# Altium project Kit_AVR_328P.PrjPCB
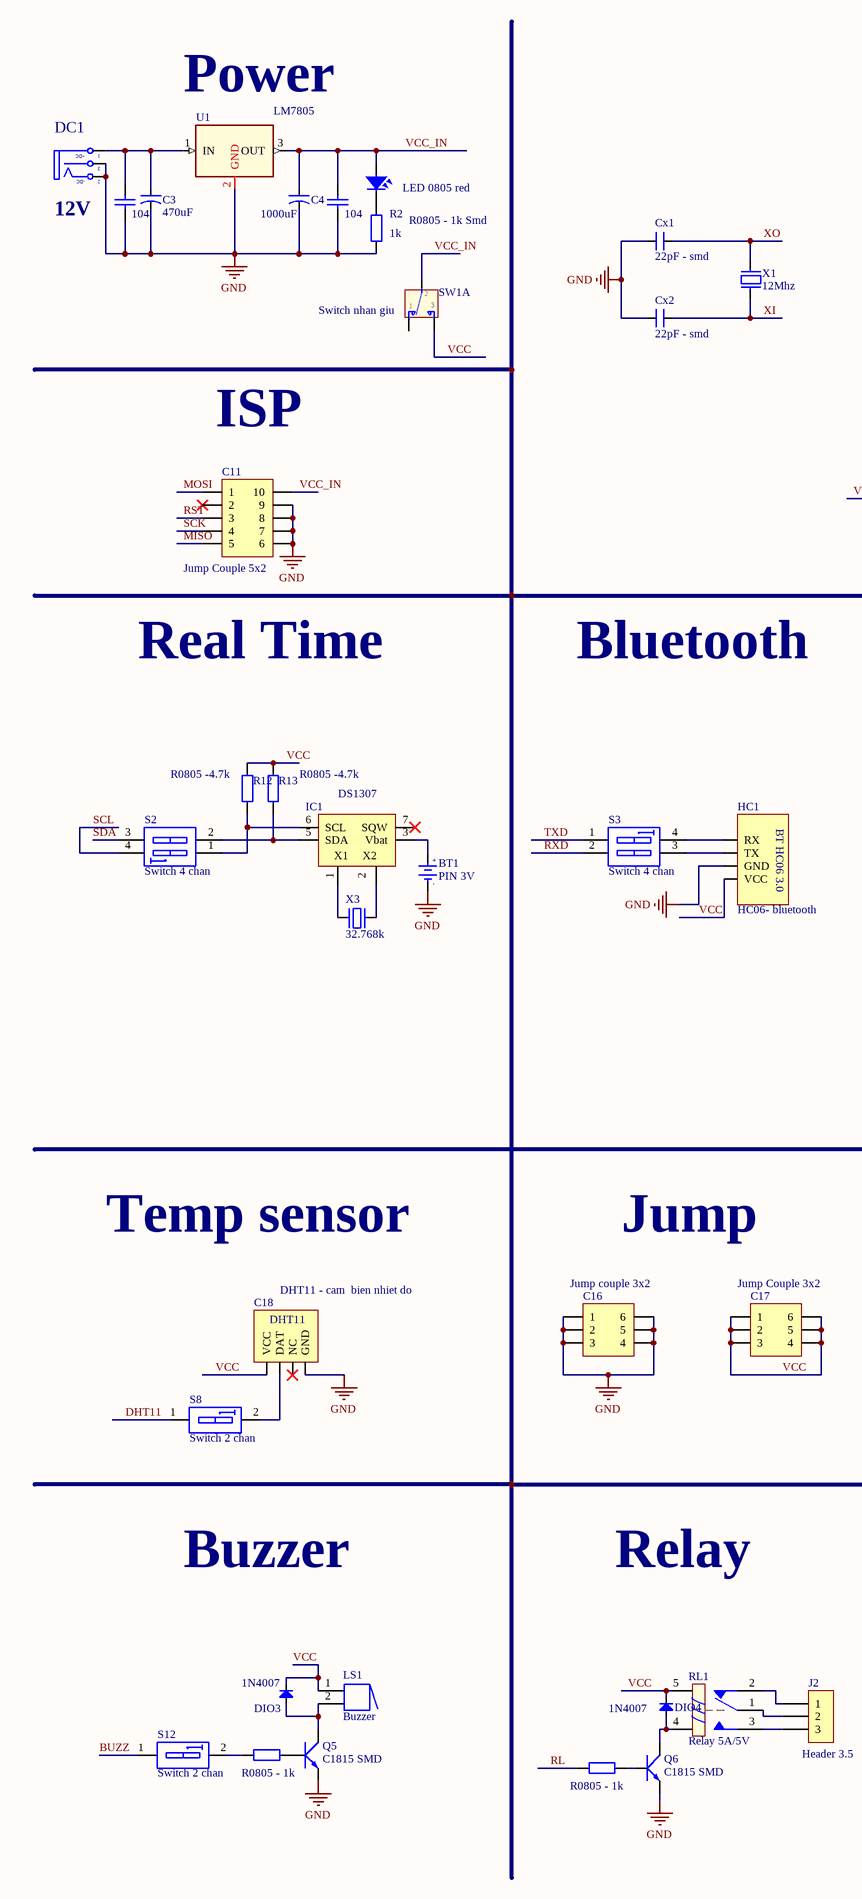
[diagram p0: Kit_AVR_328P.SchDoc, left]
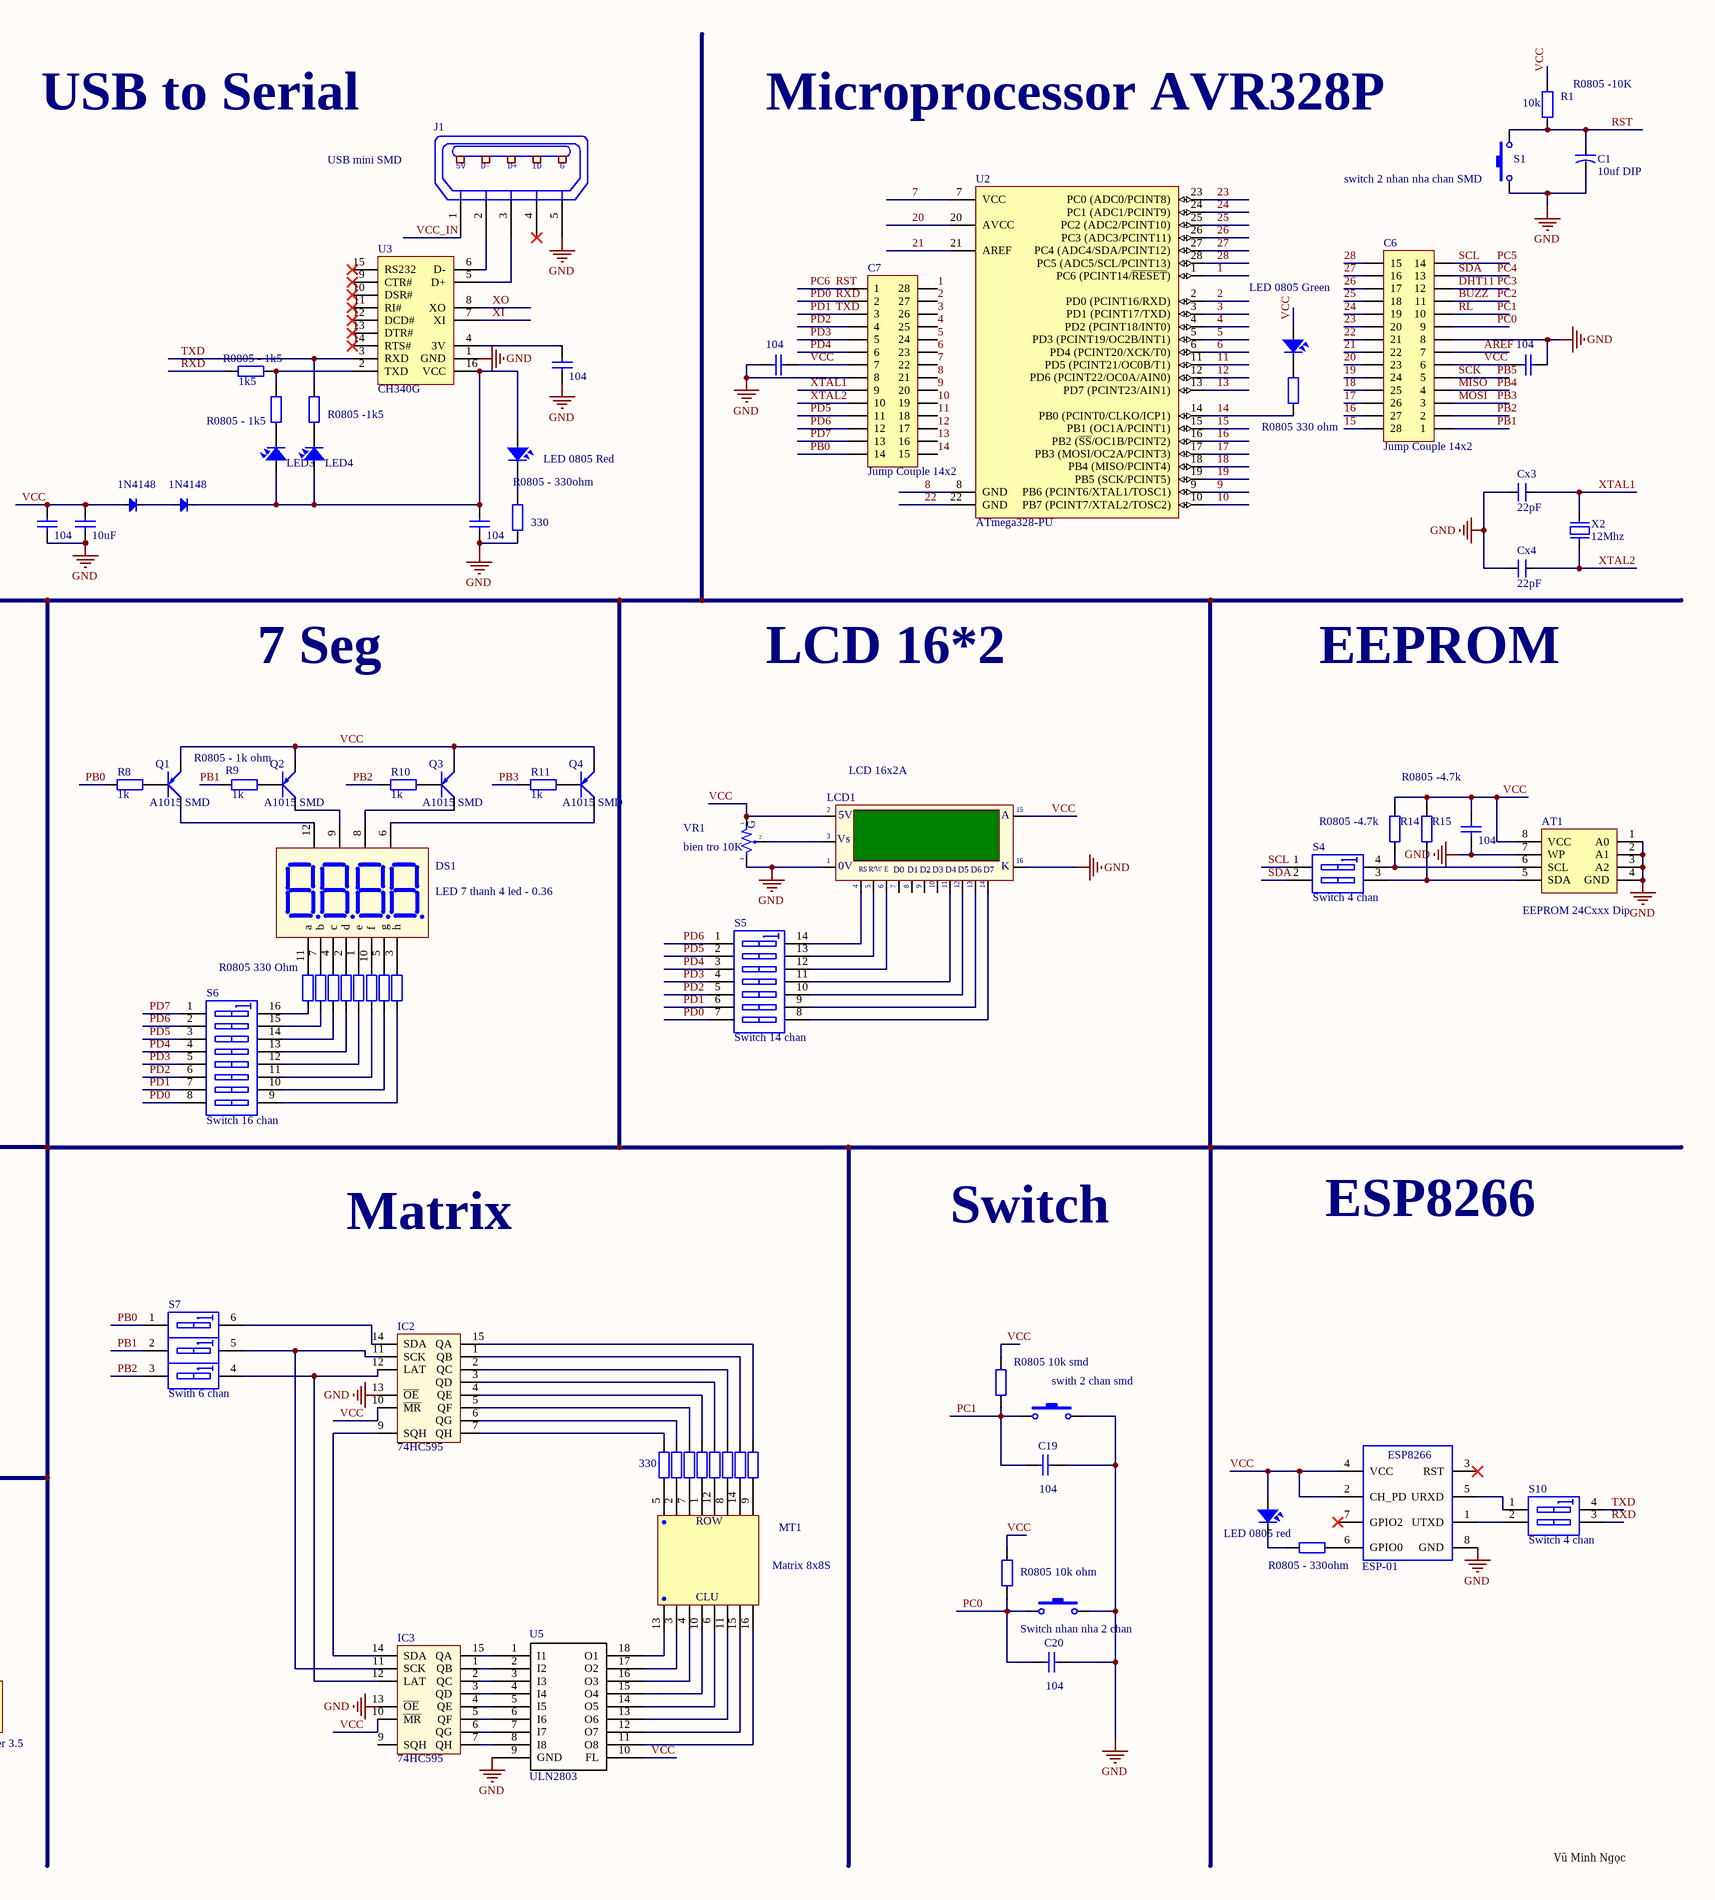
[diagram p1: Kit_AVR_328P.SchDoc, right]
1 sheet, 112 parts. Net scope: global (net labels, ports and power ports of the same name join across sheets).
Board file: Kit_AVR_328P.PcbDoc

## Sheet Kit_AVR_328P.SchDoc
size C

### Parts
AT1  EEPROM 24Cxxx Dip  [Dip8]
BT1  PIN 3V  [PIN3V]
C1  10uf DIP  [CA-ALU-2.54]
C2  104  [C0805]
C3  470uF  [CA-ALU-2.54]
C4  1000uF  [CA-ALU-2.54]
C5  104  [C0805]
C6  Jump Couple 14x2  [JP14-D2T]
C7  Jump Couple 14x2  [JP14-D2T]
C8  104  [C0805]
C9  104  [C0805]
C10  104  [C0805]
C11  Jump Couple 5x2  [JP5-D2T]
C12  104  [C0805]
C13  10uF  [C0805]
C14  104  [C0805]
C15  104  [C0805]
C16  Jump couple 3x2  [JP3-D2T]
C17  Jump Couple 3x2  [JP3-D2T]
C18  DHT11 - cam  bien nhiet do  [DHT11]
C19  104  [C0805]
C20  104  [C0805]
Cx1  22pF - smd  [CN-SMD-0805]
Cx2  22pF - smd  [CN-SMD-0805]
Cx3  22pF  [CN-SMD-0805]
Cx4  22pF  [CN-SMD-0805]
DC1  12V  [DC-IN]
DIO1  1N4148  [DIO-SMD-123]
DIO2  1N4148  [DIO-SMD-123]
DIO3  1N4007  [DIO-SMD-106]
DIO4  1N4007  [DIO-SMD-123]
DS1  LED 7 thanh 4 led - 0.36  [LED7SEG-4-0.36]
HC1  HC06- bluetooth  [HC06-1]
IC1  DS1307  [DIP8]
IC2  74HC595  [SO16]
IC3  74HC595  [SO16]
J1  USB mini SMD  [USB-M1]
J2  Header 3.5  [KF3-3.5]
LCD1  LCD 16x2A  [LCD16X2]
LED1  LED 0805 red  [LED-0805-Yellow]
LED2  LED 0805 Green  [LED-0805-Yellow]
LED3  LED 0805 red  [LED-0805-Yellow]  (value not drawn)
LED4  LED 0805 red  [LED-0805-Yellow]  (value not drawn)
LED5  LED 0805 Red  [LED-0805-Yellow]
LED6  LED 0805 red  [LED-0805-Yellow]
LS1  Buzzer  [Buzzer]
MT1  Matrix 8x8S  [Matrix]
Q1  A1015 SMD  [SOT23B]
Q2  A1015 SMD  [SOT23B]
Q3  A1015 SMD  [SOT23B]
Q4  A1015 SMD  [SOT23B]
Q5  C1815 SMD  [SOT23B]
Q6  C1815 SMD  [SOT23B]
R1  R0805 -10K  value 10k  [DIEN TRO 0805]
R2  R0805 - 1k Smd  value 1k  [DIEN TRO 0805]
R3  R0805 - 1k5  value 1k5  [DIEN TRO 0805]
R4  R0805 330 ohm  [DIEN TRO 0805]
R5  R0805 - 1k5  [DIEN TRO 0805]
R6  R0805 -1k5  [DIEN TRO 0805]
R7  R0805 - 330ohm  value 330  [DIEN TRO 0805]
R8  value 1k  [DIEN TRO 0805]  (hidden comment: R0805 - 1k ohm)
R9  R0805 - 1k ohm  value 1k  [DIEN TRO 0805]
R10  value 1k  [DIEN TRO 0805]  (hidden comment: R0805 - 1k ohm)
R11  value 1k  [DIEN TRO 0805]  (hidden comment: R0805 - 1k ohm)
R12  R0805 -4.7k  [DIEN TRO 0805]
R13  R0805 -4.7k  [DIEN TRO 0805]
R14  R0805 -4.7k  [DIEN TRO 0805]
R15  R0805 -4.7k  [DIEN TRO 0805]
R16  R0805 330 Ohm  [DIEN TRO 0805]
R17  R0805 330 Ohm  [DIEN TRO 0805]  (value not drawn)
R18  R0805 330 Ohm  [DIEN TRO 0805]  (value not drawn)
R19  R0805 330 Ohm  [DIEN TRO 0805]  (value not drawn)
R20  R0805 330 Ohm  [DIEN TRO 0805]  (value not drawn)
R21  R0805 330 Ohm  [DIEN TRO 0805]  (value not drawn)
R22  R0805 330 Ohm  [DIEN TRO 0805]  (value not drawn)
R23  R0805 330 Ohm  [DIEN TRO 0805]  (value not drawn)
R24  R0805 10k smd  [DIEN TRO 0805]
R25  value 330  [DIEN TRO 0805]  (hidden comment: R0805 -330 ohm)
R26  R0805 -330 ohm  [DIEN TRO 0805]  (value not drawn)
R27  R0805 -330 ohm  [DIEN TRO 0805]  (value not drawn)
R28  R0805 -330 ohm  [DIEN TRO 0805]  (value not drawn)
R29  R0805 -330 ohm  [DIEN TRO 0805]  (value not drawn)
R30  R0805 -330 ohm  [DIEN TRO 0805]  (value not drawn)
R31  R0805 -330 ohm  [DIEN TRO 0805]  (value not drawn)
R32  R0805 -330 ohm  [DIEN TRO 0805]  (value not drawn)
R33  R0805 - 330ohm  [DIEN TRO 0805]
R34  R0805 10k ohm  [DIEN TRO 0805]
R35  R0805 - 1k  [DIEN TRO 0805]
R36  R0805 - 1k  [DIEN TRO 0805]
RL1  Relay 5A/5V  [RL_SPDT_10A]
S1  switch 2 nhan nha chan SMD  [SW-SMD]
S2  Switch 4 chan  [SW-DIP2]
S3  Switch 4 chan  [SW-DIP2]
S4  Switch 4 chan  [SW-DIP2]
S5  Switch 14 chan  [SW-DIP7-1]
S6  Switch 16 chan  [SW-DIP8]
S7  Swith 6 chan  [SW-DIP3-1]
S8  Switch 2 chan  [SW-DIP1-1]
S9  swith 2 chan smd  [SW-SMD]
S10  Switch 4 chan  [SW-DIP2]
S11  Switch nhan nha 2 chan  [SW-SMD]
S12  Switch 2 chan  [SW-DIP1-1]
SW1  Switch nhan giu  [SW6]  (part A of 2)
U1  LM7805  [TO-263]
U2  ATmega328-PU  [DIP28]
U3  CH340G  [SO16]
U4  ESP-01  [ESP8266]
U5  ULN2803  [SO18]
VR1  bien tro 10K  [VR-S2]
X1  12Mhz  [XT2]
X2  12Mhz  [XT2]
X3  32.768k  [XT32k]

### Nets
GND: AT1.1(A0) AT1.2(A1) AT1.3(A2) AT1.4(GND) AT1.7(WP) BT1.2(GND) C1.2 C2.1 C3.2 C4.2 C5.1 C6.8 C7.8 C8.1 C9.2 C10.1 C11.6 C11.7 C11.8 C11.9 C12.1 C13.1 C14.1 C15.1 C16.1 C16.2 C16.3 C16.4 C16.5 C16.6 C18.4(GND) C19.2 C20.2 Cx1.2 Cx2.2 Cx3.2 Cx4.2 DC1.2(TN) DC1.3(S) HC1.3(GND) IC1.4(GND) IC2.8(GND) IC2.13(~{OE}) IC3.8(GND) IC3.13(~{OE}) J1.5(P5) LCD1.1(GND) LCD1.16(K) Q5.1(E) Q6.1(E) R2.1 R7.1 S1.1 S9.2 S11.2 U1.2(GND) U3.1(GND) U4.8(GND) U5.9(GND) VR1.3
VCC: AT1.8(VCC) C6.6 C7.7 C8.2 C9.1 C12.2 C13.2 C15.2 C17.1 C17.2 C17.3 C17.4 C17.5 C17.6 C18.1(VCC) DIO1.1(A) DIO3.2(K) DIO4.2(K) HC1.4(VCC) IC1.8(VCC) IC2.10(~{MR}) IC2.16(VCC) IC3.10(~{MR}) IC3.16(VCC) LCD1.2(VDD) LCD1.15(A) LED2.1 LED6.1 LS1.1 Q1.1(E) Q2.1(E) Q3.1(E) Q4.1(E) R1.2 R12.2 R13.2 R14.2 R15.2 R24.2 R34.2 RL1.5 SW1.3 U4.2(CH_PD) U4.4(VCC) U5.10(FL) VR1.1
1: C7.28 U2.1(PC6_(PCINT14/~{RESET}))
2: C7.27 U2.2(PD0_(PCINT16/RXD))
3: C7.26 U2.3(PD1_(PCINT17/TXD))
4: C7.25 U2.4(PD2_(PCINT18/INT0))
5: C7.24 U2.5(PD3_(PCINT19/OC2B/INT1))
6: C7.23 U2.6(PD4_(PCINT20/XCK/T0))
7: C7.22 U2.7(VCC)
8: C7.21 U2.8(GND)
9: C7.20 U2.9(PB6_(PCINT6/XTAL1/TOSC1))
10: C7.19 U2.10(PB7_(PCINT7/XTAL2/TOSC2))
11: C7.18 U2.11(PD5_(PCINT21/OC0B/T1))
12: C7.17 U2.12(PD6_(PCINT22/OC0A/AIN0))
13: C7.16 U2.13(PD7_(PCINT23/AIN1))
14: C7.15 R4.1 U2.14(PB0_(PCINT0/CLKO/ICP1))
15: C6.28 U2.15(PB1_(OC1A/PCINT1))
16: C6.27 U2.16(PB2_(~{SS}/OC1B/PCINT2))
17: C6.26 U2.17(PB3_(MOSI/OC2A/PCINT3))
18: C6.25 U2.18(PB4_(MISO/PCINT4))
19: C6.24 U2.19(PB5_(SCK/PCINT5))
20: C6.23 U2.20(AVCC)
21: C6.22 U2.21(AREF)
22: C6.21 U2.22(GND)
23: C6.20 U2.23(PC0_(ADC0/PCINT8))
24: C6.19 U2.24(PC1_(ADC1/PCINT9))
25: C6.18 U2.25(PC2_(ADC2/PCINT10))
26: C6.17 U2.26(PC3_(ADC3/PCINT11))
27: C6.16 U2.27(PC4_(ADC4/SDA/PCINT12))
28: C6.15 U2.28(PC5_(ADC5/SCL/PCINT13))
AREF: C6.7
BUZZ: C6.11 S12.1  [also labelled PC2]
DHT11: C6.12 S8.1  [also labelled PC3]
MISO: C6.4 C11.5  [also labelled PB4]
MOSI: C6.3 C11.1 R11.2  [also labelled PB3]
PB0: C7.14 R8.2 S7.1
PB1: C6.1 R9.2 S7.2
PB2: C6.2 R10.2 S7.3
PB5: C6.5 C11.4  [also labelled SCK]
PC0: C6.9 C20.1 R34.1 S11.1
PC1: C6.10 C19.1 R24.1 R36.2 S9.1  [also labelled RL]
PC4: C6.13 S2.3 S4.2  [also labelled SDA]
PC5: C6.14 S2.4 S4.1  [also labelled SCL]
PC6: C1.1 C7.1 C11.3 R1.1 S1.2  [also labelled RST]
PD0: C7.2 R3.1 S3.2 S5.7 S6.8 S10.3  [also labelled RXD]
PD1: C7.3 R6.1 S3.1 S5.6 S6.7 S10.4 U3.3(RXD)  [also labelled TXD]
PD2: C7.4 S5.5 S6.6
PD3: C7.5 S5.4 S6.5
PD4: C7.6 S5.3 S6.4
PD5: C7.11 S5.2 S6.3
PD6: C7.12 S5.1 S6.2
PD7: C7.13 S6.1
VCC_IN: C4.1 C5.2 C11.10 J1.1(P1) LED1.1 SW1.2 U1.3(OUT)
XI: Cx2.1 U3.7(XI) X1.1
XO: Cx1.1 U3.8(XO) X1.2
XTAL1: C7.9 Cx3.1 X2.2
XTAL2: C7.10 Cx4.1 X2.1
NetAT1_5: AT1.5(SDA) R15.1 S4.3
NetAT1_6: AT1.6(SCL) R14.1 S4.4
NetBT1_1: BT1.1(+3V) IC1.3(Vbat)
NetC2_2: C2.2 C3.1 DC1.1(T) U1.1(IN)
NetC10_2: C10.2 U3.4(3V)
NetC14_2: C14.2 DIO2.2(K) LED3.1 LED4.1 LED5.1 U3.16(VCC)
NetC18_2: C18.2(DAT) S8.2
NetDIO1_2: DIO1.2(K) DIO2.1(A)
NetDIO3_1: DIO3.1(A) LS1.2 Q5.2(C)
NetDIO4_1: DIO4.1(A) Q6.2(C) RL1.4
NetDS1_1: DS1.1(e) R20.2
NetDS1_2: DS1.2(d) R19.2
NetDS1_3: DS1.3(h) R23.2
NetDS1_4: DS1.4(c) R18.2
NetDS1_5: DS1.5(g) R22.2
NetDS1_6: DS1.6(V4) Q4.2(C)
NetDS1_7: DS1.7(b) R17.2
NetDS1_8: DS1.8(V3) Q3.2(C)
NetDS1_9: DS1.9(V2) Q2.2(C)
NetDS1_10: DS1.10(f) R21.2
NetDS1_11: DS1.11(a) R16.2
NetDS1_12: DS1.12(V1) Q1.2(C)
NetHC1_1: HC1.1(RX) S3.4
NetHC1_2: HC1.2(TX) S3.3
NetIC1_1: IC1.1(X1) X3.1
NetIC1_2: IC1.2(X2) X3.2
NetIC1_5: IC1.5(SDA) R13.1 S2.2
NetIC1_6: IC1.6(SCL) R12.1 S2.1
NetIC2_1: IC2.1(QB) R31.1
NetIC2_2: IC2.2(QC) R30.1
NetIC2_3: IC2.3(QD) R29.1
NetIC2_4: IC2.4(QE) R28.1
NetIC2_5: IC2.5(QF) R27.1
NetIC2_6: IC2.6(QG) R26.1
NetIC2_7: IC2.7(QH) R25.1
NetIC2_9: IC2.9(SQH) IC3.14(SDA)
NetIC2_11: IC2.11(SCK) IC3.11(SCK) S7.5
NetIC2_12: IC2.12(LAT) IC3.12(LAT) S7.4
NetIC2_14: IC2.14(SDA) S7.6
NetIC2_15: IC2.15(QA) R32.1
NetIC3_1: IC3.1(QB) U5.2(I2)
NetIC3_2: IC3.2(QC) U5.3(I3)
NetIC3_3: IC3.3(QD) U5.4(I4)
NetIC3_4: IC3.4(QE) U5.5(I5)
NetIC3_5: IC3.5(QF) U5.6(I6)
NetIC3_6: IC3.6(QG) U5.7(I7)
NetIC3_7: IC3.7(QH) U5.8(I8)
NetIC3_15: IC3.15(QA) U5.1(I1)
NetJ1_2: J1.2(P2) U3.6(D-)
NetJ1_3: J1.3(P3) U3.5(D+)
NetJ2_1: J2.1 RL1.2
NetJ2_2: J2.2 RL1.1
NetJ2_3: J2.3 RL1.3
NetLCD1_3: LCD1.3(VEE) VR1.2
NetLCD1_4: LCD1.4(RS) S5.14
NetLCD1_5: LCD1.5(R/~{W}) S5.13
NetLCD1_6: LCD1.6(~{EN}) S5.12
NetLCD1_11: LCD1.11(D4) S5.11
NetLCD1_12: LCD1.12(D5) S5.10
NetLCD1_13: LCD1.13(D6) S5.9
NetLCD1_14: LCD1.14(D7) S5.8
NetLED1_2: LED1.2 R2.2
NetLED2_2: LED2.2 R4.2
NetLED3_2: LED3.2 R5.2
NetLED4_2: LED4.2 R6.2
NetLED5_2: LED5.2 R7.2
NetLED6_2: LED6.2 R33.2
NetMT1_1: MT1.1(H4) R28.2
NetMT1_2: MT1.2(H2) R26.2
NetMT1_3: MT1.3(C2) U5.17(O2)
NetMT1_4: MT1.4(C3) U5.16(O3)
NetMT1_5: MT1.5(H1) R25.2
NetMT1_6: MT1.6(C5) U5.14(O5)
NetMT1_7: MT1.7(H3) R27.2
NetMT1_8: MT1.8(H6) R30.2
NetMT1_9: MT1.9(H8) R32.2
NetMT1_10: MT1.10(C4) U5.15(O4)
NetMT1_11: MT1.11(C6) U5.13(O6)
NetMT1_12: MT1.12(H5) R29.2
NetMT1_13: MT1.13(C1) U5.18(O1)
NetMT1_14: MT1.14(H7) R31.2
NetMT1_15: MT1.15(C7) U5.12(O7)
NetMT1_16: MT1.16(C8) U5.11(O8)
NetQ1_3: Q1.3(B) R8.1
NetQ2_3: Q2.3(B) R9.1
NetQ3_3: Q3.3(B) R10.1
NetQ4_3: Q4.3(B) R11.1
NetQ5_3: Q5.3(B) R35.1
NetQ6_3: Q6.3(B) R36.1
NetR3_2: R3.2 R5.1 U3.2(TXD)
NetR16_1: R16.1 S6.16
NetR17_1: R17.1 S6.15
NetR18_1: R18.1 S6.14
NetR19_1: R19.1 S6.13
NetR20_1: R20.1 S6.12
NetR21_1: R21.1 S6.11
NetR22_1: R22.1 S6.10
NetR23_1: R23.1 S6.9
NetR33_1: R33.1 U4.6(GPIO0)
NetR35_2: R35.2 S12.2
NetS10_1: S10.1 U4.5(URXD)
NetS10_2: S10.2 U4.1(UTXD)

Not connected (* = marked no-connect by the designer): C11 2*; C18 3(NC)*; IC1 7(SQW)*; IC3 9(SQH); J1 4(P4)*; LCD1 7(D0) 8(D1) 9(D2) 10(D3); SW1 1; U3 9(CTR#)* 10(DSR#)* 11(RI#)* 12(DCD#)* 13(DTR#)* 14(RTS#)* 15(RS232)*; U4 3(RST)* 7(GPIO2)*

### Notes on the sheet
- (near U1) Power
- USB to Serial
- Microprocessor AVR328P
- ISP
- Real Time
- Bluetooth
- 7 Seg
- LCD 16*2
- EEPROM
- ESP8266
- Temp sensor
- Jump
- Matrix
- Switch
- Buzzer
- Relay
- Vũ Minh Ngọc
- (in symbol DCIN) +DC; -DC
- (in symbol ESP8266-01) ESP8266
- (in symbol HC06-1) BT HC06 3.0
- (in symbol LCD16x2A) 5V; Vs; |; 0V; R/W; E
- (in symbol LED 8x8S) ROW; CLU
- (in symbol PIN 3V) +; -
- (in symbol USB-5) 5V; D-; D+; ID; G
- (in symbol VR-S) G

### Library data of the parts
AT1 = EEPROM.24Cxxx: 2-wire Serial   EEPROM  512K (65,536 x 8); Manufacturer: Atmel; Value: 512Kb; ComponentLink2Description: Open datasheet; ComponentLink2URL: H:\LIBRARY\LIBRARY.Datasheet\24c512.pdf
BT1 = PIN 3V: Battery 3VDC; Value: PIN 3V
C1 C3 C4 = CN-ALU-DIP: Capacitor (Semiconductor SIM Model); Value: 104; LatestRevisionDate: 17-Jul-2002; LatestRevisionNote: Re-released for DXP Platform.; PackageReference: C1206; Publisher: Altium Limited
C2 C5 C8-C10 C12-C15 C19 C20 = CapSMD: Capacitor; Value: 33p; Published: 8-Jun-2000; LatestRevisionDate: 17-Jul-2002; LatestRevisionNote: Re-released for DXP Platform.; PackageReference: RAD-0.3; Publisher: Altium Limited
C6 C7 = JP14x2: WR-PHD 2.54 mm Dual Socket Header; Manufacturer: W¨¹rth Elektronik eiSos GmbH; partNo: 61302821821; ComponentLink1 Description: Manufacturer; ComponentLink2 Description: Datasheet; NoPins: 28; Created Date: 29 March 2013; ComponentLink1URL: http://www.we-online.com; ComponentLink2URL: http://katalog.we-online.de/em/datasheet/6130xx21821.pdf; Created by: Karrer Zheng
C11 = JP5x2: WR-PHD 2.54 mm Dual Socket Header; Manufacturer: W¨¹rth Elektronik eiSos GmbH; partNo: 61301021821; ComponentLink1 Description: Manufacturer; ComponentLink2 Description: Datasheet; NoPins: 10; Created Date: 29 March 2013; ComponentLink1URL: http://www.we-online.com; ComponentLink2URL: http://katalog.we-online.de/em/datasheet/6130xx21821.pdf; Created by: Karrer Zheng
C16 C17 = JP3x2: WR-PHD 2.54 mm Dual Socket Header; Manufacturer: W¨¹rth Elektronik eiSos GmbH; partNo: 61300621821; ComponentLink1 Description: Manufacturer; ComponentLink2 Description: Datasheet; NoPins: 06; Created Date: 29 March 2013; ComponentLink1URL: http://www.we-online.com; ComponentLink2URL: http://katalog.we-online.de/em/datasheet/6130xx21821.pdf; Created by: Karrer Zheng
C18 = DHT11: Manufacturer: W¨¹rth Elektronik eiSos GmbH; partNo: 613004143121; ComponentLink1 Description: Manufacturer; ComponentLink2 Description: Datasheet; NoPins: 04; Created Date: 29 March 2013; ComponentLink1URL: http://www.we-online.com; ComponentLink2URL: http://katalog.we-online.de/em/datasheet/6130xx143121.pdf; Created by: Karrer Zheng
Cx1-Cx4 = CN: Value: 33pF
DC1 = DCIN: Jac DC input; Value: Jac DC
DIO1-DIO4 = Diode SMD: Default Diode; Code - JEDEC: DO-214-AB; Value: 1N5007; Published: 8-Jun-2000; Revision: July-2002: Re-released for DXP Platform.; Publisher: Altium Limited
DS1 = LED7SEG-4: Four 7 Seg Dipslay; Value: LED 7Q SEG
HC1 = HC06-1: Manufacturer: W¨¹rth Elektronik eiSos GmbH; partNo: 613004143121; ComponentLink1 Description: Manufacturer; ComponentLink2 Description: Datasheet; NoPins: 04; Created Date: 29 March 2013; ComponentLink1URL: http://www.we-online.com; ComponentLink2URL: http://katalog.we-online.de/em/datasheet/6130xx143121.pdf; Created by: Karrer Zheng
IC1 = DS1307: Real Timer Serial; Value: DS1307
IC2 IC3 = 74595: 8 Bit Serial input - Parallel Output; Value: 74HC595
J1 = USB-5: Manufacturer: FCI; Manufacturer Part Number: 10118193-0001LF; Connector Type: USB - micro B; Number of Contacts: 5; Gender: Receptacle; Specifications: USB 2.0; .Creator: MM; .Checked PCB: RF; Supplier 1: Digi-Key; RoHS: RoHS Compliant; Category: Connectors, Interconnects; Stock 1: 28642; Pricing 1: 1=0.46, 10=0.433, 25=0.3712, 50=0.3156, 100=0.3032, 250=0.27224, 500=0.25988 (USD); Packaging: Cut Tape (CT); Mounting Type: Surface Mount, Right Angle, Horizontal; Features: Shielded, Solder Retention; Ingress Protection: -; ComponentLink1URL: http://portal.fciconnect.com/Comergent//fci/drawing/10118193.pdf; ComponentLink1Description: http://portal.fciconnect.com/Comergent//fci/drawing/10118193.pdf; Supplier Part Number 1: 609-4616-1-ND; .Checked SCH: MM
J2 = KF3: Manufacturer: Würth Elektronik eiSos GmbH; partNo: 691103110003; ComponentLink1 Description: Manufacturer; ComponentLink2 Description: Datasheet; NoPins: 3; Created Date: 29 October 2013; ComponentLink1URL: http://www.we-online.com; ComponentLink2URL: http://katalog.we-online.de/em/datasheet/6911031100xx.pdf; Created by: Karrer Zheng
LCD1 = LCD16x2A: LCD dipslay 16 char, 2 line; Value: LCD16x2A
LED1-LED6 = LED SMD: Value: LED 3 - 5 ly 2 Colour
LS1 = Buzzer: Magnetic Transducer Buzzer; Published: 24-Mar-1999; LatestRevisionDate: 17-Dec-2003; LatestRevisionNote: Schematic revised, PCB Footprint replaced.; DatasheetDocument: 17-Dec-2003; PackageReference: ABSM-1574; Publisher: Altium Limited; ComponentLink1Description: Manufacturer Link; ComponentLink1URL: http://www.megastar.com/linecard/buzzmode/index.php
MT1 = LED 8x8S: Matrix 8x8,  Single colour; Value: Matrix 8x8S
Q1-Q4 = A1015: PNP 600mW, ECB; Value: A1015
Q5 Q6 = C1815: NPN 600mW, ECB; Value: C1815
R1-R3 R5 R7-R11 R24 R25 R34-R36 = R0805: Resistor SMD 0805; Published: 8-Jun-2000; LatestRevisionDate: 17-Jul-2002; LatestRevisionNote: Re-released for DXP Platform.; PackageReference: AXIAL-0.4; Publisher: Altium Limited
  R5: Value: 1k5
  R24 R34: Value: 10k
  R35 R36: Value: 1k
R4 R16-R23 R26-R33 = R0805: Resistor SMD 0805; Value: 330; Published: 8-Jun-2000; LatestRevisionDate: 17-Jul-2002; LatestRevisionNote: Re-released for DXP Platform.; PackageReference: AXIAL-0.4; Publisher: Altium Limited
R6 = R0805: Resistor SMD 0805; Value: 1k5; Published: 8-Jun-2000; LatestRevisionDate: 17-Jul-2002; LatestRevisionNote: Re-released for DXP Platform.; PackageReference: AXIAL-0.4; Publisher: Altium Limited
R12-R15 = R0805: Resistor SMD 0805; Value: 4.7k; Published: 8-Jun-2000; LatestRevisionDate: 17-Jul-2002; LatestRevisionNote: Re-released for DXP Platform.; PackageReference: AXIAL-0.4; Publisher: Altium Limited
RL1 = Relay 1: Relay SPDT,10A - 12VDC 5 Pin; Value: Relay SPDT, 10A, 12V
S1 S9 S11 = SW-SMD: Switch; Published: 24-Mar-1999; LatestRevisionDate: 17-Jul-2002; LatestRevisionNote: Re-released for DXP Platform.; PackageReference: SPST-2; Publisher: Altium Limited
S2-S4 S10 = SWDIP2: WS-DITV 2.54 mm small compact THT flat actuator with top tape; Manufacturer: Wurth Elektronik; Part No.: 418127160902; ComponentLink1 Description: Manufacturer; ComponentLink2 Description: Datasheet; Pole: 02; Created Date: Dec.2015; ComponentLink1URL: http://www.we-online.com; ComponentLink2URL: http://katalog.we-online.de/em/datasheet/4181271609xx.pdf; Created by: Baojun Chen
S5 = SWDIP7: WS-DITV 2.54 mm small compact THT flat actuator with top tape; Manufacturer: Wurth Elektronik; Part No.: 418127160907; ComponentLink1 Description: Manufacturer; ComponentLink2 Description: Datasheet; Pole: 07; Created Date: Dec.2015; ComponentLink1URL: http://www.we-online.com; ComponentLink2URL: http://katalog.we-online.de/em/datasheet/4181271609xx.pdf; Created by: Baojun Chen
S6 = SWDIP8: WS-DITV 2.54 mm small compact THT flat actuator with top tape; Manufacturer: Wurth Elektronik; Part No.: 418127160908; ComponentLink1 Description: Manufacturer; ComponentLink2 Description: Datasheet; Pole: 08; Created Date: Dec.2015; ComponentLink1URL: http://www.we-online.com; ComponentLink2URL: http://katalog.we-online.de/em/datasheet/4181271609xx.pdf; Created by: Baojun Chen
S7 = SWDIP3: WS-DITV 2.54 mm small compact THT flat actuator with top tape; Manufacturer: Wurth Elektronik; Part No.: 418127160901; ComponentLink1 Description: Manufacturer; ComponentLink2 Description: Datasheet; Pole: 01; Created Date: Dec.2015; ComponentLink1URL: http://www.we-online.com; ComponentLink2URL: http://katalog.we-online.de/em/datasheet/4181271609xx.pdf; Created by: Baojun Chen
S8 S12 = SWDIP1: WS-DITV 2.54 mm small compact THT flat actuator with top tape; Manufacturer: Wurth Elektronik; Part No.: 418127160901; ComponentLink1 Description: Manufacturer; ComponentLink2 Description: Datasheet; Pole: 01; Created Date: Dec.2015; ComponentLink1URL: http://www.we-online.com; ComponentLink2URL: http://katalog.we-online.de/em/datasheet/4181271609xx.pdf; Created by: Baojun Chen
SW1 = SW6A: SW-DTDP - 6 Pin; Value: SW6
U1 = LM78xx: Regulator; Manufacturer: Fairchild Semiconductor Corporation; PSpiceTemplate: X^@REFDES %IN %OUT %GND @MODEL; Vendor: Digikey; Output Current: Up to 1A; V out: 5V; Tolerance: 4 %; Value: LM7805CT; Published: 13-April-2009; Publisher: Hoang Nguyen; ComponentLink1Description: Digikey Part Link; ComponentLink2Description: Open Datasheet; ComponentLink2URL: H:\LIBRARY\LIBRARY.Datasheet\LM7805.pdf; Price: 2500 VND
U2 = ATmega328-PU: 8-bit AVR Microcontroller, 32KB Flash, 1KB EEPROM, 2KB SRAM, 28-pin PDIP, Industrial Grade (-40°C to 85°C); Published: 1-Apr-2010; DatasheetVersion: revA, Jan-2010; PackageVersion: revB, Sep-2001; PackageReference: 28P3; Publisher: Altium Limited; PackageDescription: 28-lead (0.300"/7.62mm Wide) Plastic Dual Inline Package (PDIP); Supplier 1: Digi-Key; Supplier Part Number 1: ATMEGA328-PU-ND; Supplier 2: Mouser; Supplier Part Number 2: 556-ATMEGA328-PU; ComponentLink1Description: Manufacturer Link; ComponentLink1URL: http://www.atmel.com/products/avr/default.asp?; ComponentLink2Description: ATmega48A/48PA/88A/88PA/168A/168PA/328/328P Datasheet; ComponentLink2URL: http://www.atmel.com/dyn/resources/prod_documents/8271.pdf; ComponentLink3Description: ATmega48A/48PA/88A/88PA/168A/168PA/328/328P Summary; ComponentLink3URL: http://www.atmel.com/dyn/resources/prod_documents/8271S.pdf; ComponentLink4Description: Atmel.com Home; ComponentLink4URL: http://www.atmel.com
U3 = CH340G: High and Low Side Driver; Note: Pins 4, 8 and 14 are not connected; Published: 8-Jun-2000; LatestRevisionDate: 04-Mar-2005; LatestRevisionNote: Stylized 3D Model Added.; DatasheetVersion: PD60147J; PackageReference: PDIP14; Publisher: Altium Limited; PackageDescription: DIP; 14 Leads; Row Spacing 7.62 mm; Pitch 2.54 mm; ComponentLink1Description: Manufacturer Link; ComponentLink1URL: http://www.irf.com/; ComponentLink2Description: Datasheet; ComponentLink2URL: http://www.irf.com/product-info/datasheets/data/ir2110.pdf
U4 = ESP8266-01: ESP-12 Wi-Fi Module
U5 = ULN2803: OCTAL HIGH CURRENT DRIVER; Manufacturer: Texas Instruments; Manufacturer Part Number: ULN2803ADWR; Number of Drivers/Receivers: 8/0; Voltage - Supply: 5V; Supplier 1: Digi-Key; Supplier Part Number 1: 296-15777-1-ND; Packaging: Cut Tape (CT); Supplier Part Number: 296-15777-1-ND; Type: Darlington Array; Supplier: Digi-Key; Protocol: -; Package / Case: 18-SOIC (7.5mm Width); Category: Integrated Circuits (ICs); RoHS: RoHS Compliant
VR1 = VR-S: Var Resistor; Value: Volume 50k
X1 = XT2: Crystal For all Crystal 2pin.; Value: 4Mhz
X2 X3 = XT2: Crystal, 32.768 KHz, -40 to 85 degC, 3.2 x 1.5 x 0.9 mm SMD; Value: 4Mhz